# Altium schematic sheet Power 5V.SchDoc
size A
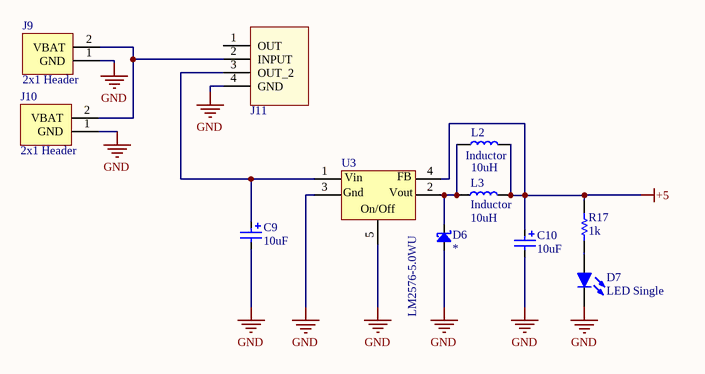
[diagram p0: Power 5V.SchDoc]

## Parts
C9  10uF  [Capacitor Through Hole 5x11]
C10  10uF  [Through hole Capacitor 16V 470uF]
D6  *  [Schottky Rectifier diode]
D7  LED Single  [LED 0603]
J9  2x1 Header  [Header 1x2 2.54mm]
J10  2x1 Header  [Header 1x2 2.54mm]
J11  Power Switch  [POWER SWITCH]  (value not drawn)
L2  Inductor  value 10uH  [Inductor 12.5x12.5x6mm]
L3  Inductor  value 10uH  [Inductor 12.5x12.5x6mm]
R17  1k  [R 0603]
U3  LM2576-5.0WU  [5V 3A REG]

## Nets
+5: C10.1 L2.2 L3.2 R17.1 U3.4
GND: C9.2 C10.2 D6.2(A) D7.2(K) J9.1(GND) J10.1(GND) J11.4(GND) U3.3 U3.5
NetC9_1: C9.1 J11.3(OUT_2) U3.1
NetD6_1: D6.1(K) L2.1 L3.1 U3.2
NetD7_1: D7.1(A) R17.2
NetJ9_2: J9.2(VBAT) J10.2(VBAT) J11.2(INPUT)

Not connected (* = marked no-connect by the designer): J11 1(OUT)

## Notes on the sheet
- (in symbol LM2576-5.0WU) Vin; FB; Gnd; Vout; On/Off

## Library data of the parts
C9 C10 = Capacitor Polarized: Capacitor; Value: 10uF
D6 = Diode Schottky: ManufacturerPN: *; FarnellPN: *
D7 = LED Single: LED
J9 J10 = 2x1 Header (power)
R17 = Res: Resistor; Value: 1k
U3 = LM2576-5.0WU: IC REG BUCK 5V 3A TO263-5; Manufacturer: Microchip Micrel; Number of Outputs: 1; Max Input Voltage: 40V; Min Input Voltage: 4V; Switching Frequency: 52kHz; Synchronous Rectifier: No; Output Type: Fixed; Output Configuration: Positive; Efficiency: 82%; Supplier 1: Farnell; Manufacturer Part Number: LM2576-5.0WU; Stock 1: 0; Mount: Surface Mount; Case/Package: TO-263; Number of Pins: 5; Min Operating Temperature: -40°C; Max Operating Temperature: 85°C; Packaging: Bulk; Output Current: 3A; Output Voltage: 5V; Package Quantity: 50; Nominal Output Voltage: 5V; Min Output Voltage: 5V; Max Output Current: 3A; Length: 10.67mm; Height: 4.59mm; Width: 9.17mm; Radiation Hardening: No; REACH SVHC: No SVHC; Lead Free: Lead Free; ComponentLink1URL: http://components.arrow.com/part/dataview/41722529S2342416N1374?src-supplier=Arrow; ComponentLink1Description: http://components.arrow.com/part/dataview/41722529S2342416N1374?src-supplier=Arrow; ComponentLink2URL: http://www.micrel.com/_PDF/lm2576.pdf?src-supplier=Future+Electronics; ComponentLink2Description: http://www.micrel.com/_PDF/lm2576.pdf?src-supplier=Future+Electronics; ComponentLink3URL: http://www.microchip.com/mymicrochip/filehandler.aspx?ddocname=en579007&src-supplier=Digi-Key; ComponentLink3Description: http://www.microchip.com/mymicrochip/filehandler.aspx?ddocname=en579007&src-supplier=Digi-Key; ComponentLink4URL: https://www.verical.com/server-webapp/html/getDatasheet?partID=716600&src-supplier=Verical; ComponentLink4Description: https://www.verical.com/server-webapp/html/getDatasheet?partID=716600&src-supplier=Verical; Supplier Part Number 1: 2100269
J11 = Power Switch: Supplier 1: Farnell